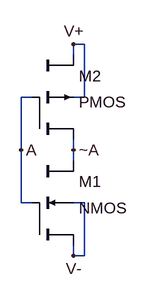
[diagram p0: schematic Inverter.asc]
Inverter.asc, the LTspice schematic file:
Version 4
SHEET 1 880 680
WIRE 288 32 272 32
WIRE 272 48 272 32
WIRE 208 112 192 112
WIRE 288 112 288 32
WIRE 288 112 272 112
WIRE 192 192 192 112
WIRE 272 192 272 176
WIRE 272 208 272 192
WIRE 192 272 192 192
WIRE 208 272 192 272
WIRE 288 272 272 272
WIRE 272 352 272 336
WIRE 288 352 288 272
WIRE 288 352 272 352
FLAG 192 192 A
FLAG 272 192 ~A
FLAG 272 32 V+
FLAG 272 352 V-
SYMBOL cktsym\\nmos4 272 272 R0
SYMATTR InstName M1
SYMATTR Value2 l=0.6um w=1.8um
SYMBOL cktsym\\pmos4 272 112 R0
SYMATTR InstName M2
SYMATTR Value2 l=0.6um w=1.8um

The netlist it stands for:
* Inverter.asc
M1 ~A A V- V- NMOS l=0.6um w=1.8um
M2 ~A A V+ V+ PMOS l=0.6um w=1.8um
.model NMOS NMOS
.model PMOS PMOS
.lib standard.mos
.backanno
.end